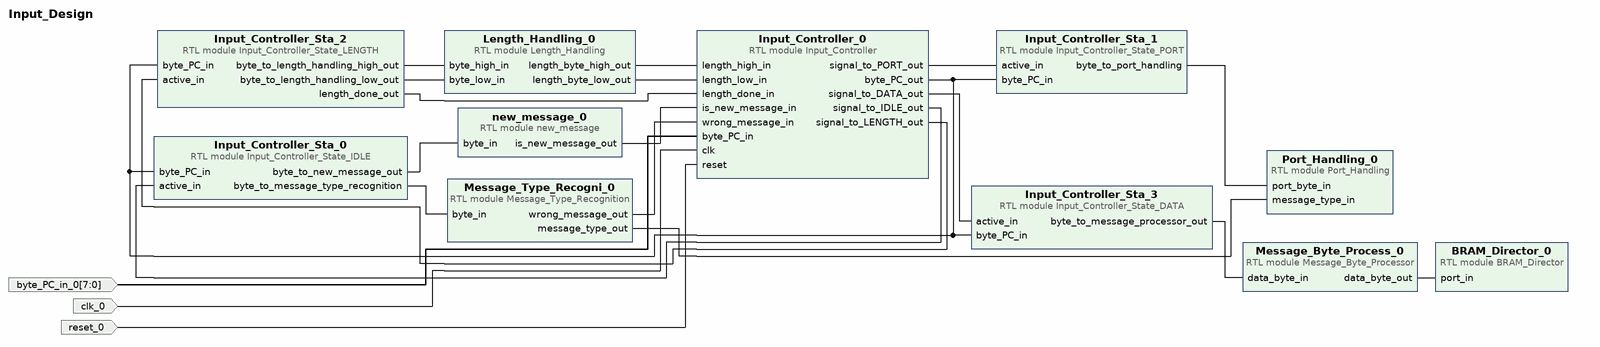
[diagram p0: block diagram of the top level]
# Vivado block design Input_Design, xc7a35tftg256-1, Vivado 2024.2
create_bd_design Input_Design

create_bd_port -dir I -from 7 -to 0 byte_PC_in_0
create_bd_port -dir I -type clk clk_0
create_bd_port -dir I -type rst reset_0

create_bd_cell -type module -reference Input_Controller_State_IDLE Input_Controller_Sta_0
create_bd_cell -type module -reference Input_Controller_State_PORT Input_Controller_Sta_1
create_bd_cell -type module -reference Input_Controller_State_LENGTH Input_Controller_Sta_2
create_bd_cell -type module -reference Input_Controller_State_DATA Input_Controller_Sta_3
create_bd_cell -type module -reference new_message new_message_0
create_bd_cell -type module -reference Message_Type_Recognition Message_Type_Recogni_0
create_bd_cell -type module -reference Length_Handling Length_Handling_0
create_bd_cell -type module -reference Message_Byte_Processor Message_Byte_Process_0
create_bd_cell -type module -reference Input_Controller Input_Controller_0
create_bd_cell -type module -reference Port_Handling Port_Handling_0
create_bd_cell -type module -reference BRAM_Director BRAM_Director_0

# ---- connections ----

connect_bd_net [get_bd_pins Input_Controller_0/byte_PC_out] \
  [get_bd_pins Input_Controller_Sta_0/byte_PC_in] [get_bd_pins Input_Controller_Sta_1/byte_PC_in] \
  [get_bd_pins Input_Controller_Sta_3/byte_PC_in] [get_bd_pins Input_Controller_Sta_2/byte_PC_in]
connect_bd_net [get_bd_pins Input_Controller_0/signal_to_DATA_out] [get_bd_pins Input_Controller_Sta_3/active_in]
connect_bd_net [get_bd_pins Input_Controller_0/signal_to_IDLE_out] [get_bd_pins Input_Controller_Sta_0/active_in]
connect_bd_net [get_bd_pins Input_Controller_0/signal_to_LENGTH_out] [get_bd_pins Input_Controller_Sta_2/active_in]
connect_bd_net [get_bd_pins Input_Controller_0/signal_to_PORT_out] [get_bd_pins Input_Controller_Sta_1/active_in]
connect_bd_net [get_bd_pins Input_Controller_Sta_0/byte_to_message_type_recognition] [get_bd_pins Message_Type_Recogni_0/byte_in]
connect_bd_net [get_bd_pins Input_Controller_Sta_0/byte_to_new_message_out] [get_bd_pins new_message_0/byte_in]
connect_bd_net [get_bd_pins Input_Controller_Sta_1/byte_to_port_handling] [get_bd_pins Port_Handling_0/port_byte_in]
connect_bd_net [get_bd_pins Input_Controller_Sta_2/byte_to_length_handling_high_out] [get_bd_pins Length_Handling_0/byte_high_in]
connect_bd_net [get_bd_pins Input_Controller_Sta_2/byte_to_length_handling_low_out] [get_bd_pins Length_Handling_0/byte_low_in]
connect_bd_net [get_bd_pins Input_Controller_Sta_2/length_done_out] [get_bd_pins Input_Controller_0/length_done_in]
connect_bd_net [get_bd_pins Input_Controller_Sta_3/byte_to_message_processor_out] [get_bd_pins Message_Byte_Process_0/data_byte_in]
connect_bd_net [get_bd_pins Length_Handling_0/length_byte_high_out] [get_bd_pins Input_Controller_0/length_high_in]
connect_bd_net [get_bd_pins Length_Handling_0/length_byte_low_out] [get_bd_pins Input_Controller_0/length_low_in]
connect_bd_net [get_bd_pins Message_Byte_Process_0/data_byte_out] [get_bd_pins BRAM_Director_0/port_in]
connect_bd_net [get_bd_pins Message_Type_Recogni_0/message_type_out] [get_bd_pins Port_Handling_0/message_type_in]
connect_bd_net [get_bd_pins Message_Type_Recogni_0/wrong_message_out] [get_bd_pins Input_Controller_0/wrong_message_in]
connect_bd_net -net byte_PC_in_0_1 [get_bd_ports byte_PC_in_0] [get_bd_pins Input_Controller_0/byte_PC_in]
connect_bd_net -net clk_0_1 [get_bd_ports clk_0] [get_bd_pins Input_Controller_0/clk]
connect_bd_net [get_bd_pins new_message_0/is_new_message_out] [get_bd_pins Input_Controller_0/is_new_message_in]
connect_bd_net -net reset_0_1 [get_bd_ports reset_0] [get_bd_pins Input_Controller_0/reset]

validate_bd_design
save_bd_design
